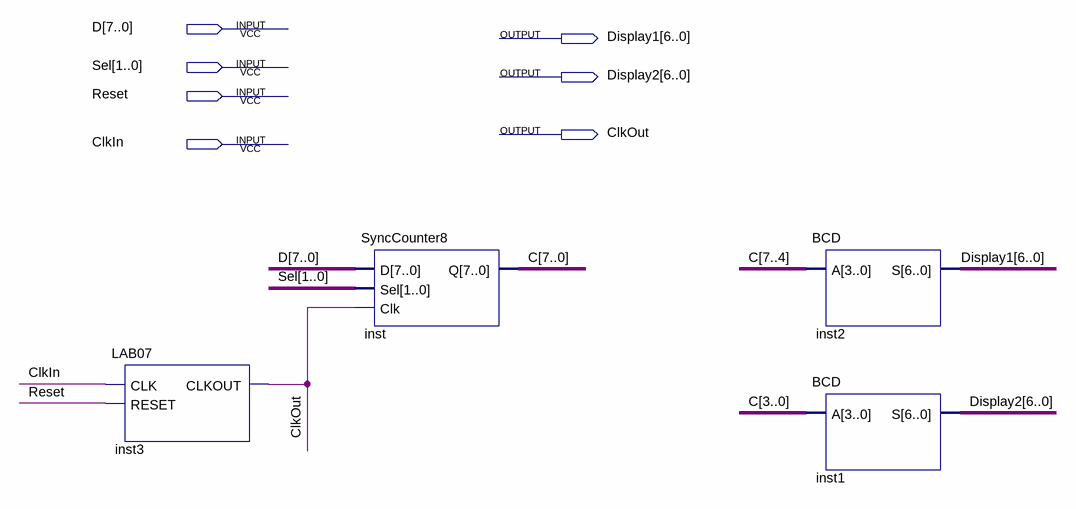
[diagram p0: schematic sheet]
// Quartus schematic CounterBCD.bdf as structural Verilog: 4 symbols, 7 pins
module CounterBCD (
  input  [7:0] D,
  input  [1:0] Sel,
  input  Reset,
  input  ClkIn,
  output [6:0] Display1,
  output [6:0] Display2,
  output ClkOut
);

  wire [7:0] C;

  LAB07 inst3 (.CLK(ClkIn), .RESET(Reset), .CLKOUT(ClkOut));
  SyncCounter8 inst (.D(D), .Sel(Sel), .Clk(ClkOut), .Q(C));
  BCD inst2 (.A(C[7:4]), .S(Display1));
  BCD inst1 (.A(C[3:0]), .S(Display2));
endmodule
